# Altium schematic sheet main_sheet.SchDoc
size A4
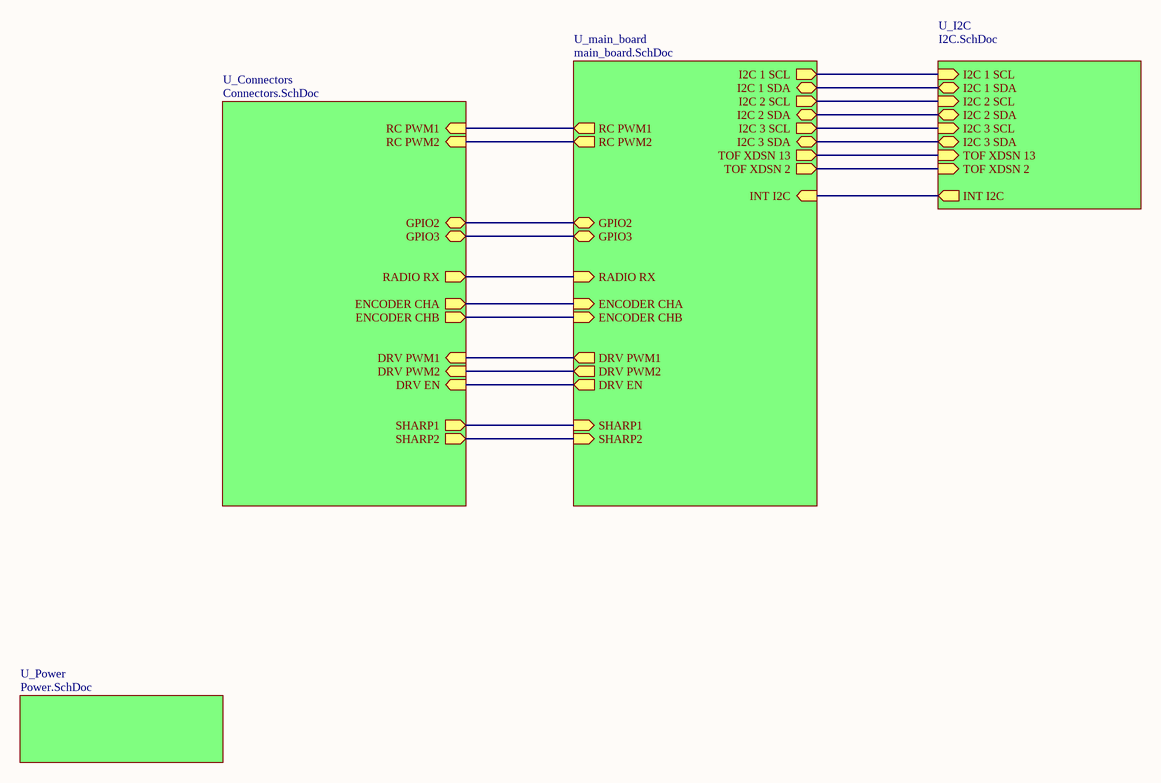
[diagram p0: main_sheet.SchDoc]

## Sub-sheets
U_Connectors = Connectors.SchDoc: RC PWM1 (in), RC PWM2 (in), ENCODER CHA (out), ENCODER CHB (out), GPIO2 (bidir), GPIO3 (bidir), RADIO RX (out), DRV EN (in), DRV PWM1 (in), DRV PWM2 (in), SHARP1 (out), SHARP2 (out)
U_I2C = I2C.SchDoc: I2C 1 SDA (bidir), I2C 1 SCL (in), TOF XDSN 13 (in), TOF XDSN 2 (in), I2C 2 SDA (bidir), I2C 2 SCL (in), I2C 3 SCL (in), I2C 3 SDA (bidir), INT I2C (out)
U_main_board = main_board.SchDoc: I2C 1 SDA (bidir), I2C 3 SDA (bidir), I2C 1 SCL (out), TOF XDSN 13 (out), TOF XDSN 2 (out), I2C 2 SDA (bidir), I2C 2 SCL (out), I2C 3 SCL (out), RC PWM1 (out), RC PWM2 (out), ENCODER CHA (in), GPIO2 (bidir), GPIO3 (bidir), ENCODER CHB (in), RADIO RX (in), DRV PWM1 (out), DRV PWM2 (out), DRV EN (out), SHARP2 (in), SHARP1 (in), INT I2C (in)
U_Power = Power.SchDoc: no entries

## Nets
(unnamed): sheet U_main_board/I2C 1 SDA, sheet U_I2C/I2C 1 SDA
(unnamed): sheet U_main_board/I2C 3 SDA, sheet U_I2C/I2C 3 SDA
(unnamed): sheet U_main_board/I2C 1 SCL, sheet U_I2C/I2C 1 SCL
(unnamed): sheet U_main_board/TOF XDSN 13, sheet U_I2C/TOF XDSN 13
(unnamed): sheet U_main_board/TOF XDSN 2, sheet U_I2C/TOF XDSN 2
(unnamed): sheet U_main_board/I2C 2 SDA, sheet U_I2C/I2C 2 SDA
(unnamed): sheet U_main_board/I2C 2 SCL, sheet U_I2C/I2C 2 SCL
(unnamed): sheet U_main_board/I2C 3 SCL, sheet U_I2C/I2C 3 SCL
(unnamed): sheet U_main_board/RC PWM1, sheet U_Connectors/RC PWM1
(unnamed): sheet U_main_board/RC PWM2, sheet U_Connectors/RC PWM2
(unnamed): sheet U_main_board/ENCODER CHA, sheet U_Connectors/ENCODER CHA
(unnamed): sheet U_main_board/GPIO2, sheet U_Connectors/GPIO2
(unnamed): sheet U_main_board/GPIO3, sheet U_Connectors/GPIO3
(unnamed): sheet U_main_board/ENCODER CHB, sheet U_Connectors/ENCODER CHB
(unnamed): sheet U_main_board/RADIO RX, sheet U_Connectors/RADIO RX
(unnamed): sheet U_main_board/DRV PWM1, sheet U_Connectors/DRV PWM1
(unnamed): sheet U_main_board/DRV PWM2, sheet U_Connectors/DRV PWM2
(unnamed): sheet U_main_board/DRV EN, sheet U_Connectors/DRV EN
(unnamed): sheet U_main_board/SHARP2, sheet U_Connectors/SHARP2
(unnamed): sheet U_main_board/SHARP1, sheet U_Connectors/SHARP1
(unnamed): sheet U_main_board/INT I2C, sheet U_I2C/INT I2C